# Altium project Project_Buran.PrjPcb
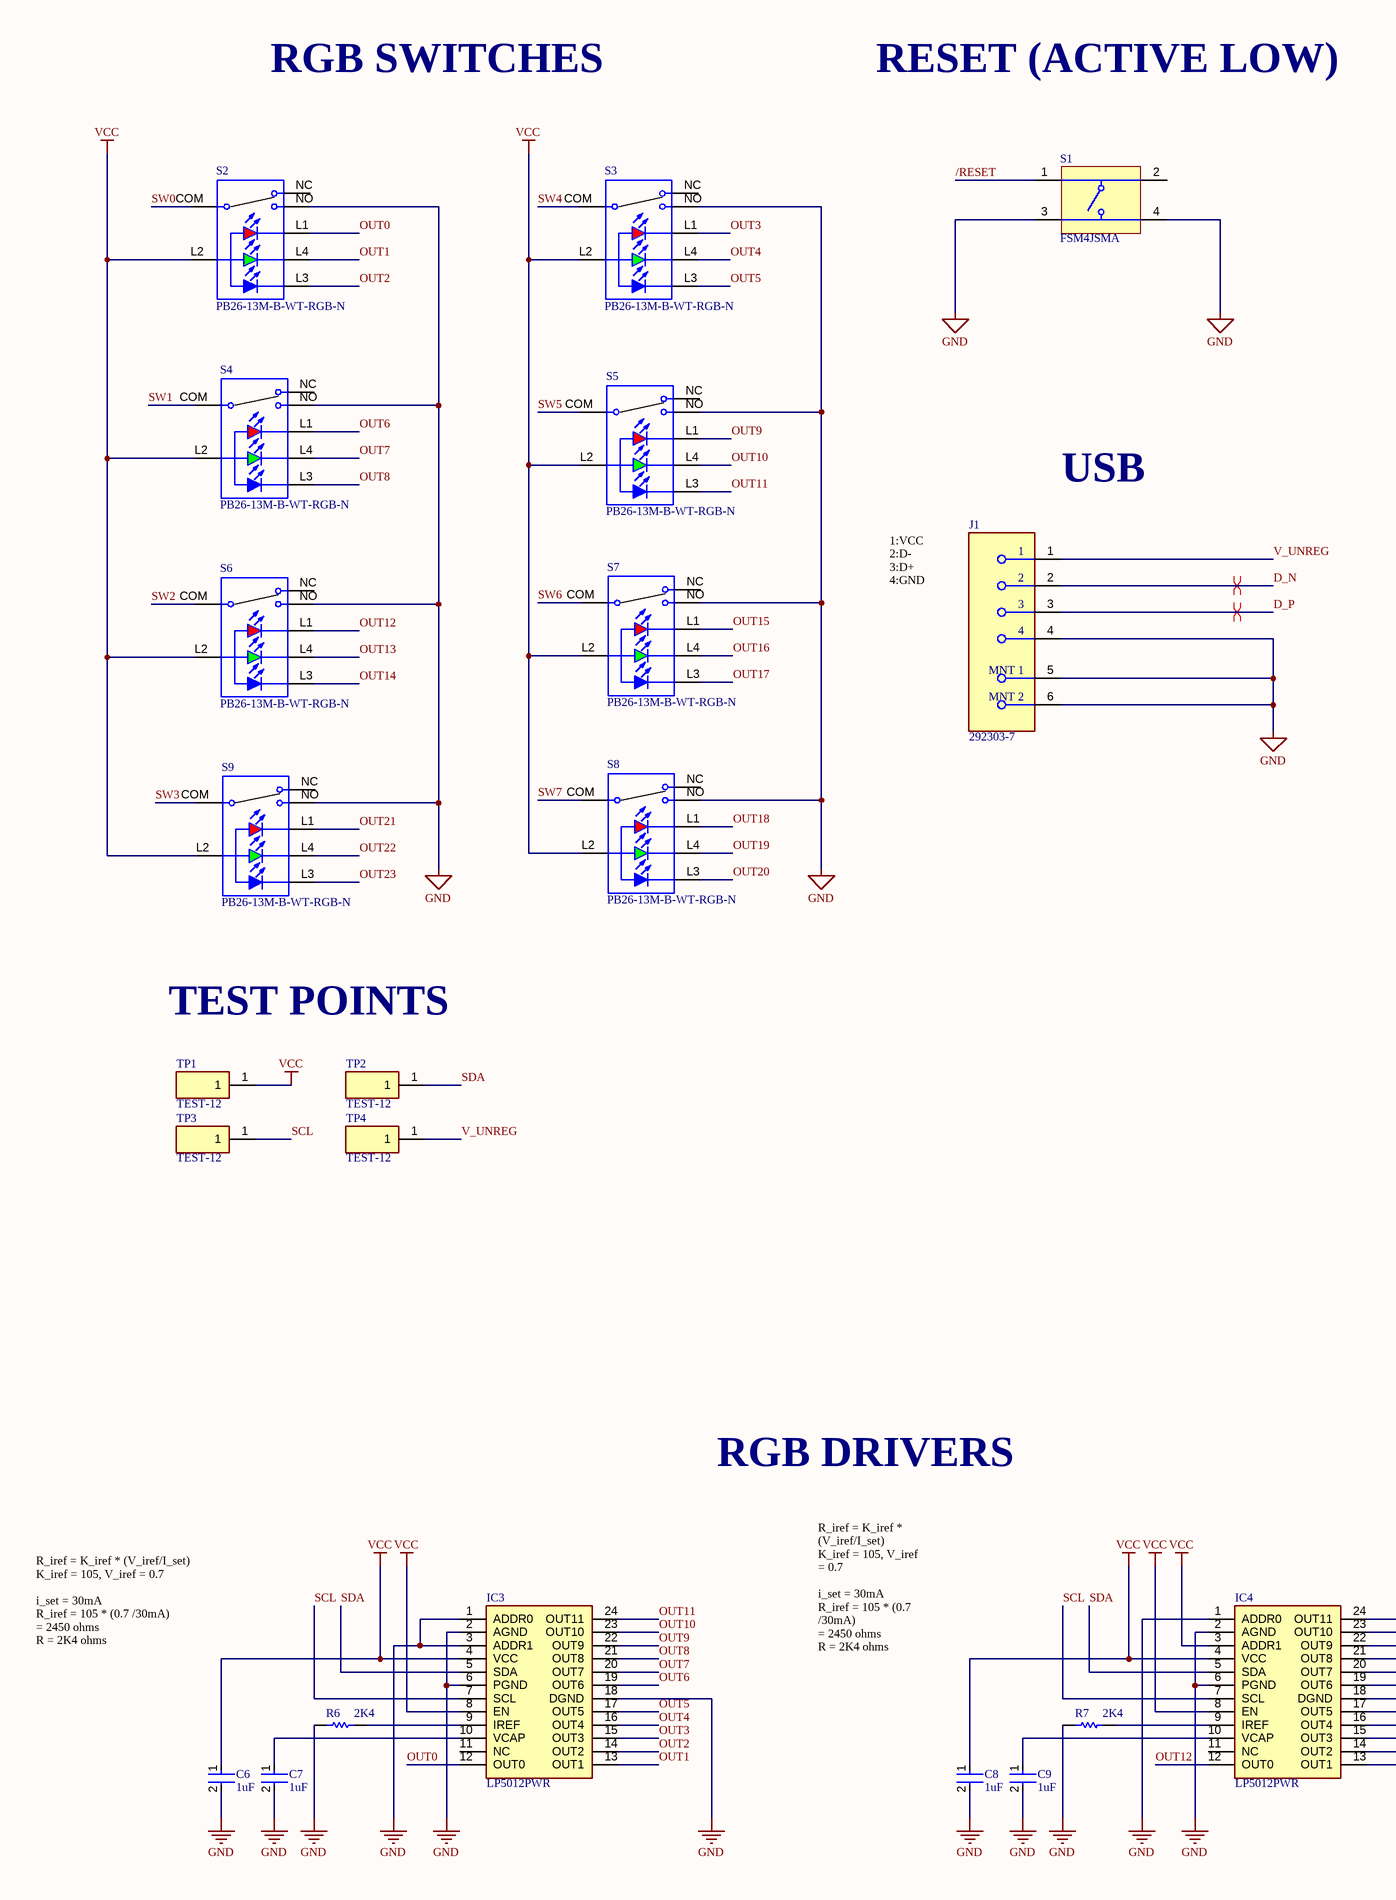
[diagram p0: project_buran_schematic.SchDoc, left]
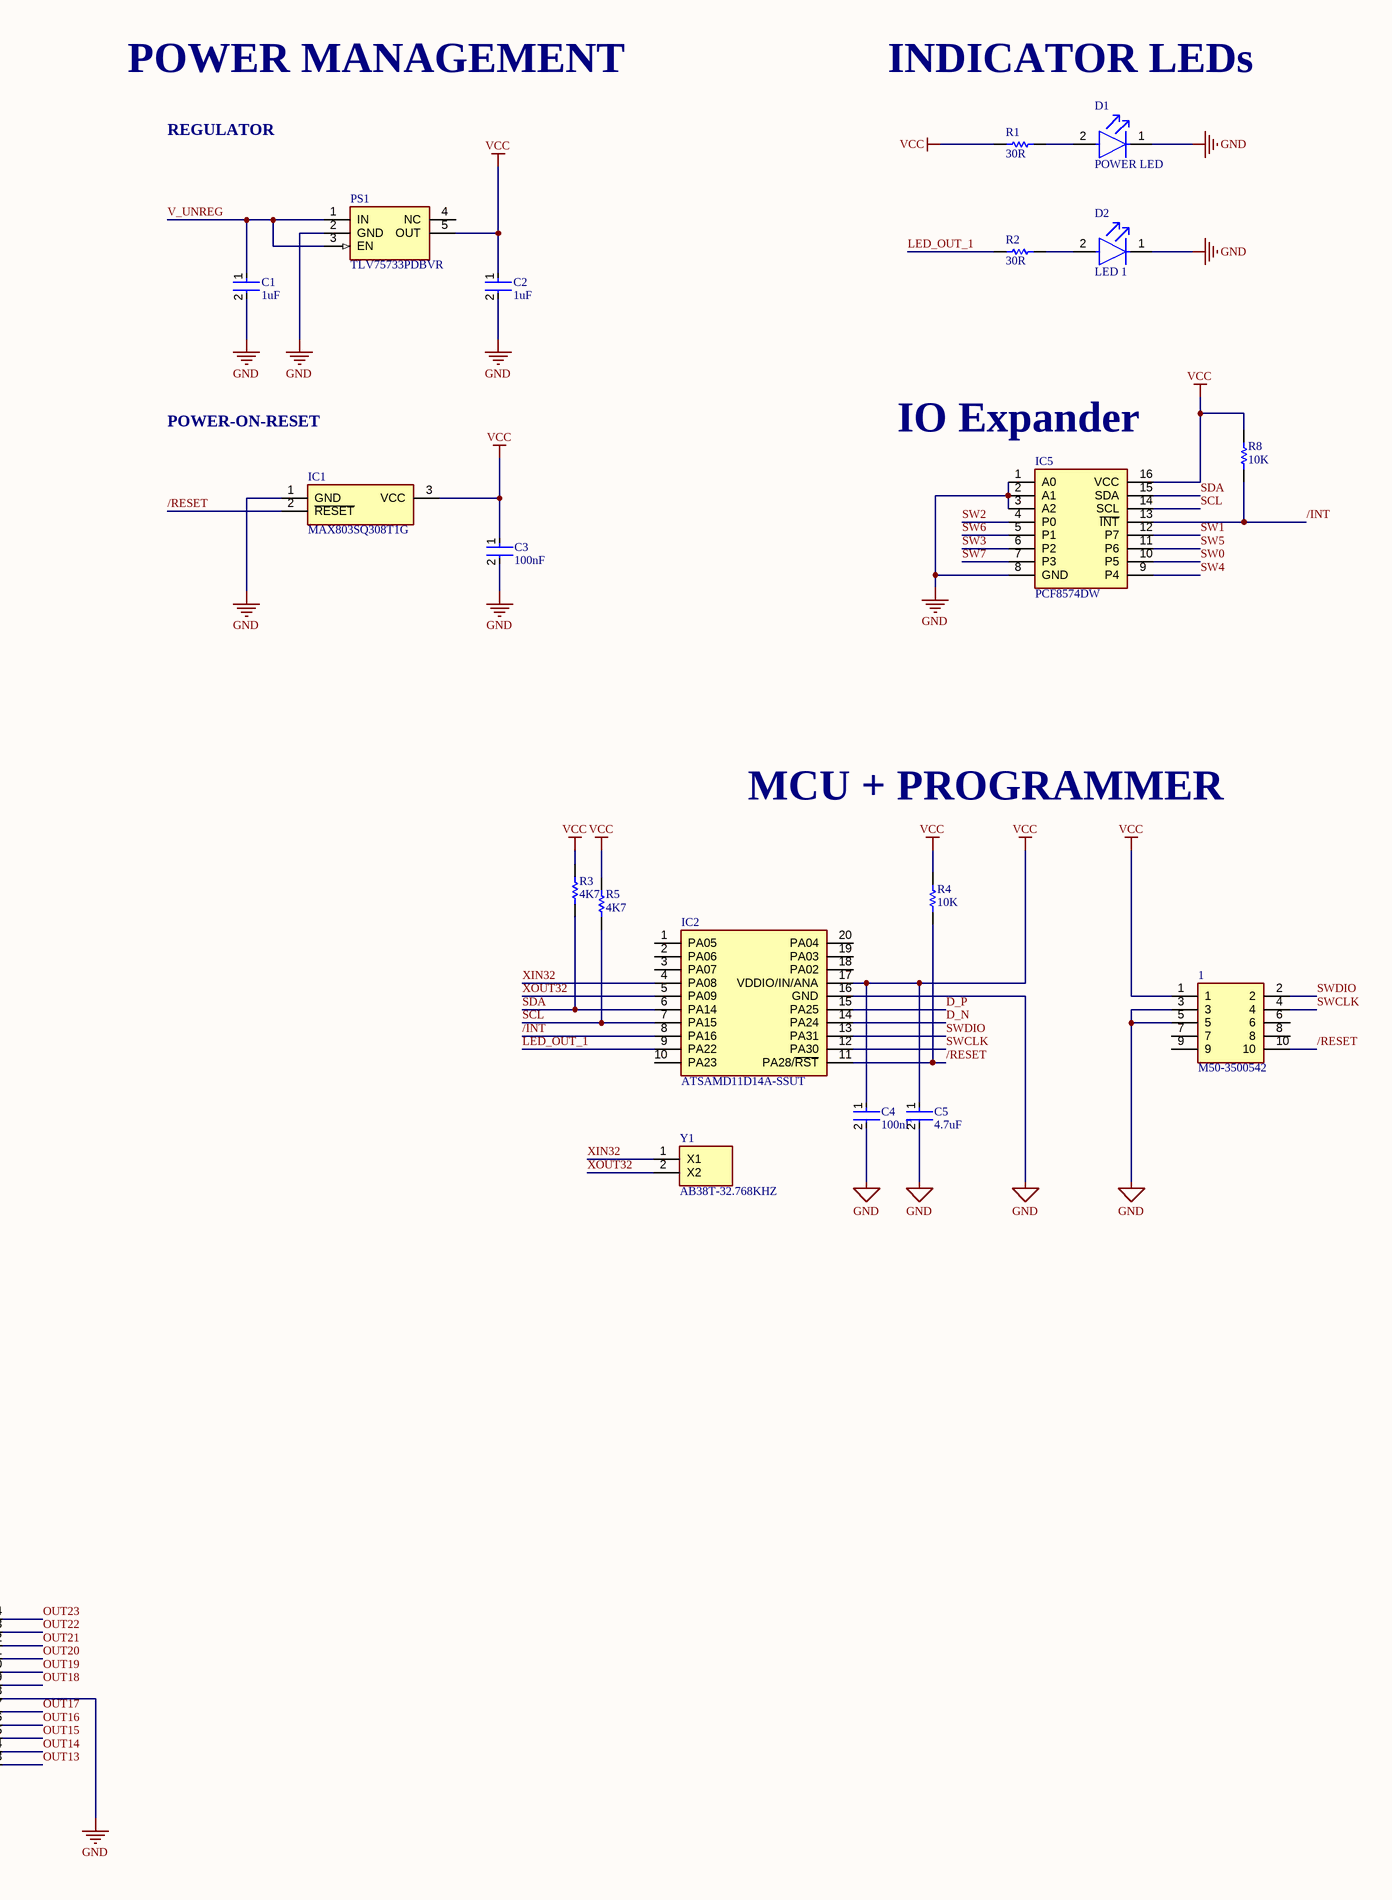
[diagram p1: project_buran_schematic.SchDoc, right]
1 sheet, 41 parts. Net scope: global (net labels, ports and power ports of the same name join across sheets).
Board file: project_buran.PcbDoc

## Sheet project_buran_schematic.SchDoc
size A2

### Parts
1  M50-3500542  [M503500542]
C1  1uF  [FP-GRM188-0_1-e0_2_0_55-IPC_A]
C2  1uF  [FP-GRM188-0_1-e0_2_0_55-IPC_A]
C3  100nF  [FP-GRM188-0_1-e0_2_0_55-IPC_A]
C4  100nF  [FP-GRM188-0_1-e0_2_0_55-IPC_A]
C5  4.7uF  [FP-GRM188-0_1-e0_2_0_55-IPC_A]
C6  1uF  [FP-GRM188-0_1-e0_2_0_55-IPC_A]
C7  1uF  [FP-GRM188-0_1-e0_2_0_55-IPC_A]
C8  1uF  [FP-GRM188-0_1-e0_2_0_55-IPC_A]
C9  1uF  [FP-GRM188-0_1-e0_2_0_55-IPC_A]
D1  POWER LED  [FP-LTST-C190GKT-MFG]
D2  LED 1  [FP-LTST-C190GKT-MFG]
IC1  MAX803SQ308T1G  [SOT65P220X100-3N]
IC2  ATSAMD11D14A-SSUT  [SOIC127P1032X265-20N]
IC3  LP5012PWR  [SOP65P640X120-24N]
IC4  LP5012PWR  [SOP65P640X120-24N]
IC5  PCF8574DW  [SOIC127P1030X265-16N]
J1  292303-7  [FP-292303-7-MFG]
PS1  TLV75733PDBVR  [SOT95P280X145-5N]
R1  30R  [RESC1609X50X30NL10T20]
R2  30R  [RESC1609X50X30NL10T20]
R3  4K7  [RESC1609X50X30NL10T20]
R4  10K  [RESC1609X50X30NL10T20]
R5  4K7  [RESC1609X50X30NL10T20]
R6  2K4  [RESC1609X50X30NL10T20]
R7  2K4  [RESC1609X50X30NL10T20]
R8  10K  [RESC1609X50X30NL10T20]
S1  FSM4JSMA  [TECO-FSM4JSMA_V]
S2  PB26-13M-B-WT-RGB-N  [PCBComponent_1 - duplicate]
S3  PB26-13M-B-WT-RGB-N  [PCBComponent_1 - duplicate]
S4  PB26-13M-B-WT-RGB-N  [PCBComponent_1 - duplicate]
S5  PB26-13M-B-WT-RGB-N  [PCBComponent_1 - duplicate]
S6  PB26-13M-B-WT-RGB-N  [PCBComponent_1 - duplicate]
S7  PB26-13M-B-WT-RGB-N  [PCBComponent_1 - duplicate]
S8  PB26-13M-B-WT-RGB-N  [PCBComponent_1 - duplicate]
S9  PB26-13M-B-WT-RGB-N  [PCBComponent_1 - duplicate]
TP1  TEST-12  [TEST12]
TP2  TEST-12  [TEST12]
TP3  TEST-12  [TEST12]
TP4  TEST-12  [TEST12]
Y1  AB38T-32.768KHZ  [AB38T32768KHZ]

### Nets
GND: 1.3 1.5 C1.2 C2.2 C3.2 C4.2 C5.2 C6.2 C7.2 C8.2 C9.2 D1.1(C) D2.1(C) IC1.1(GND) IC2.16(GND) IC3.1(ADDR0) IC3.2(AGND) IC3.3(ADDR1) IC3.6(PGND) IC3.18(DGND) IC4.1(ADDR0) IC4.2(AGND) IC4.6(PGND) IC4.18(DGND) IC5.1(A0) IC5.2(A1) IC5.3(A2) IC5.8(GND) J1.4 J1.5(MNT_1) J1.6(MNT_2) PS1.2(GND) R6.1 R7.1 S1.3 S1.4 S2.NO S3.NO S4.NO S5.NO S6.NO S7.NO S8.NO S9.NO
VCC: 1.1 C2.1 C3.1 C4.1 C5.1 C6.1 C8.1 IC1.3(VCC) IC2.17(VDDIO/IN/ANA) IC3.4(VCC) IC3.8(EN) IC4.3(ADDR1) IC4.4(VCC) IC4.8(EN) IC5.16(VCC) PS1.5(OUT) R1.2 R3.2 R4.2 R5.2 R8.2 S2.L2 S3.L2 S4.L2 S5.L2 S6.L2 S7.L2 S8.L2 S9.L2 TP1.1
/INT: IC2.8(PA16) IC5.13(~{INT}) R8.1
/RESET: 1.10 IC1.2(~{RESET}) IC2.11(PA28/~{RST}) R4.1 S1.1
D_N: IC2.14(PA24) J1.2
D_P: IC2.15(PA25) J1.3
LED_OUT_1: IC2.9(PA22) R2.2
OUT0: IC3.12(OUT0) S2.L1(L4)
OUT1: IC3.13(OUT1) S2.L4
OUT2: IC3.14(OUT2) S2.L3(L2)
OUT3: IC3.15(OUT3) S3.L1(L4)
OUT4: IC3.16(OUT4) S3.L4
OUT5: IC3.17(OUT5) S3.L3(L2)
OUT6: IC3.19(OUT6) S4.L1(L4)
OUT7: IC3.20(OUT7) S4.L4
OUT8: IC3.21(OUT8) S4.L3(L2)
OUT9: IC3.22(OUT9) S5.L1(L4)
OUT10: IC3.23(OUT10) S5.L4
OUT11: IC3.24(OUT11) S5.L3(L2)
OUT12: IC4.12(OUT0) S6.L1(L4)
OUT13: IC4.13(OUT1) S6.L4
OUT14: IC4.14(OUT2) S6.L3(L2)
OUT15: IC4.15(OUT3) S7.L1(L4)
OUT16: IC4.16(OUT4) S7.L4
OUT17: IC4.17(OUT5) S7.L3(L2)
OUT18: IC4.19(OUT6) S8.L1(L4)
OUT19: IC4.20(OUT7) S8.L4
OUT20: IC4.21(OUT8) S8.L3(L2)
OUT21: IC4.22(OUT9) S9.L1(L4)
OUT22: IC4.23(OUT10) S9.L4
OUT23: IC4.24(OUT11) S9.L3(L2)
SCL: IC2.7(PA15) IC3.7(SCL) IC4.7(SCL) IC5.14(SCL) R5.1 TP3.1
SDA: IC2.6(PA14) IC3.5(SDA) IC4.5(SDA) IC5.15(SDA) R3.1 TP2.1
SW0: IC5.10(P5) S2.COM
SW1: IC5.12(P7) S4.COM
SW2: IC5.4(P0) S6.COM
SW3: IC5.6(P2) S9.COM
SW4: IC5.9(P4) S3.COM
SW5: IC5.11(P6) S5.COM
SW6: IC5.5(P1) S7.COM
SW7: IC5.7(P3) S8.COM
SWCLK: 1.4 IC2.12(PA30)
SWDIO: 1.2 IC2.13(PA31)
V_UNREG: C1.1 J1.1 PS1.1(IN) PS1.3(EN) TP4.1
XIN32: IC2.4(PA08) Y1.1(X1)
XOUT32: IC2.5(PA09) Y1.2(X2)
NetC7_1: C7.1 IC3.10(VCAP)
NetC9_1: C9.1 IC4.10(VCAP)
NetD1_2: D1.2(A) R1.1
NetD2_2: D2.2(A) R2.1
NetIC3_9: IC3.9(IREF) R6.2
NetIC4_9: IC4.9(IREF) R7.2

Not connected (* = marked no-connect by the designer): 1 6 7 8 9; IC2 1(PA05) 2(PA06) 3(PA07) 10(PA23) 18(PA02) 19(PA03) 20(PA04); IC3 11(NC); IC4 11(NC); PS1 4(NC); S1 2; S2 NC; S3 NC; S4 NC; S5 NC; S6 NC; S7 NC; S8 NC; S9 NC

### Layout directives
differential pair: D_N, D_P

### Notes on the sheet
- RGB SWITCHES
- RESET (ACTIVE LOW)
- POWER MANAGEMENT
- INDICATOR LEDs
- REGULATOR
- POWER-ON-RESET
- (near IC5) IO Expander
- USB
- 1:VCC
  2:D-
  3:D+
  4:GND
- MCU + PROGRAMMER
- TEST POINTS
- RGB DRIVERS
- R_iref = K_iref * (V_iref/I_set)
  K_iref = 105, V_iref = 0.7
  i_set = 30mA
  R_iref = 105 * (0.7 /30mA)
  = 2450 ohms
  R = 2K4 ohms
- DWG. NO.
- REV.
- SHT.
- REVISION
- DESCRIPTION
- DATE
- APPROVED
- THIS DOCUMENT AND THE DATA DISCLOSED HEREIN OR HEREWITH IS THE PROPERTY OF ALTIUM LIMITED AND MAY BE FREELY DISTRIBUTED IN WHOLE. NO RIGHTS ARE RESERVED OR EXPRESS OR IMPLIED WARANTEE GIVEN.
- ENG:
- DSN:
- APPROVALS
- PROJECT
- DOCUMENT REVISION:
- DESIGN ITEM:
- CHK:
- BOM:
- REFERENCE DOCUMENTS
- PROJECT REVISION:
- TITLE
- FAB DWG:
- PCB DWG:
- ASSY DWG:
- SCALE:
- SIZE
- C
- CAGE CODE
- FILE NAME
- DWG NO.
- SHEET
- OF
- REV

### Library data of the parts
1 = M50-3500542: Connector; Manufacturer_Name: Harwin; Datasheet Link: http://docs-emea.rs-online.com/webdocs/13d4/0900766b813d4011.pdf; Height: 4.15mm; Manufacturer_Part_Number: M50-3500542; Mouser Part Number: 855-M50-3500542; Mouser Price/Stock: https://www.mouser.co.uk/ProductDetail/Harwin/M50-3500542?qs=9fQaSFfsqsyXI0P9tFOVoQ%3D%3D
C1-C9 = CMP-2006-02792-2: Chip Multilayer Ceramic Capacitors for General Purpose, 0603, 10uF, X5R, 15%, 20%, 6.3V; Packaging: Tape and Reel; Voltage Rating (DC): 6.3V; Width: 0.031inch; Termination: SMD/SMT; Dielectric: X5R; Package Quantity: 4000; Voltage Rating: 6.3V; Capacitance: 10uF; Case/Package: 0603; Min Operating Temperature: -55°C; Voltage: 6.3V; Length: 1.6mm; Thickness: 0.035inch; Lead Free: Lead Free; Depth: 0.8mm; Case Code (Imperial): 0603; Max Operating Temperature: 85°C; Material: Ceramic; Height: 0.8mm; Tolerance: 20%; Mount: Surface Mount; REACH SVHC: No SVHC; Radiation Hardening: No; Case Code (Metric): 1608
D1 D2 = CMP-22017-000005-2: LED GREEN CLEAR CHIP SMD; Dominant Wavelength: 569nm; Reverse Voltage: 5V; Lens Color: Colorless; Viewing Angle: 130°; Voltage: 2V; Forward Current: 30mA; Power Dissipation: 100mW; Luminous Intensity: 6mcd; Number of LEDs: 1; Forward Voltage: 2.1V; Wavelength: 565nm; Test Current: 10mA; Min Operating Temperature: -55°C; Lens Style: Clear; Mount: Surface Mount; Width: 0.8mm; Packaging: Tape and Reel; Lens Transparency: Clear; Case Code (Metric): 1608; Depth: 0.8mm; Case Code (Imperial): 0603; Case/Package: 0603; Number of Pins: 2; Max Operating Temperature: 85°C; Lead Free: Lead Free; Number of Elements: 1; Length: 1.6mm; Height: 0.8mm; Package Quantity: 1; Power Rating: 100mW; Radiation Hardening: No; Illumination Color: Green; Color: Green
IC1 = MAX803SQ308T1G: Integrated Circuit; Manufacturer_Name: ON Semiconductor; Datasheet Link: http://www.onsemi.com/pub/Collateral/MAX803-D.PDF; Height: 1mm; Manufacturer_Part_Number: MAX803SQ308T1G; Mouser Part Number: 863-MAX803SQ308T1G; Mouser Price/Stock: https://www.mouser.co.uk/ProductDetail/ON-Semiconductor/MAX803SQ308T1G?qs=aSUclzrs14xj4ys5ck7Tew%3D%3D; Arrow Part Number: MAX803SQ308T1G; Arrow Price/Stock: https://www.arrow.com/en/products/max803sq308t1g/on-semiconductor
IC2 = ATSAMD11D14A-SSUT: Integrated Circuit; Manufacturer_Name: Microchip; Datasheet Link: http://ww1.microchip.com/downloads/en/devicedoc/atmel-42363-sam-d11_datasheet.pdf; Height: 2.65mm; Manufacturer_Part_Number: ATSAMD11D14A-SSUT; Mouser Part Number: 556-ATSAMD11D14ASSUT; Mouser Price/Stock: https://www.mouser.co.uk/ProductDetail/Microchip-Technology-Atmel/ATSAMD11D14A-SSUT/?qs=lrqjml%252Bjt8f8EFewxXrzCw%3D%3D; Arrow Part Number: ATSAMD11D14A-SSUT; Arrow Price/Stock: https://www.arrow.com/en/products/atsamd11d14a-ssut/microchip-technology
IC3 IC4 = LP5012PWR: Integrated Circuit; Manufacturer_Name: Texas Instruments; Datasheet Link: https://www.ti.com/lit/ds/symlink/lp5012.pdf?ts=1615929314042&ref_url=https%253A%252F%252Fwww.mouser.co.uk%252F; Height: 1.2mm; Manufacturer_Part_Number: LP5012PWR; Mouser Part Number: 595-LP5012PWR; Mouser Price/Stock: https://www.mouser.co.uk/ProductDetail/Texas-Instruments/LP5012PWR/?qs=T94vaHKWudSL6jLwBy12Hg%3D%3D
IC5 = PCF8574DW: Integrated Circuit; Manufacturer_Name: Texas Instruments; Datasheet Link: http://www.ti.com/lit/ds/symlink/pcf8574.pdf; Height: 2.65mm; Manufacturer_Part_Number: PCF8574DW; Mouser Part Number: 595-PCF8574DW; Mouser Price/Stock: https://www.mouser.co.uk/ProductDetail/Texas-Instruments/PCF8574DW?qs=wgAEGBTxy7mRAJubebRPoQ%3D%3D; Arrow Part Number: PCF8574DW; Arrow Price/Stock: https://www.arrow.com/en/products/pcf8574dw/texas-instruments
J1 = CMP-03360-000008-1: CONN RCPT USB2.0 TYPEA 4P SMD RA; Manufacturer: TE Connectivity; Is Female: yes; Current Rating: 1A; Number Of Contacts: 4; Voltage Rating: 30V; Conn Orientation: Right Angle; Shielding: true; Digikey Description: CONN RCPT USB2.0 TYPEA 4P SMD RA; Manufacturer Part Number: 292303-7; Automotive: No; Category: Conn; Temperature: -55°C to +85°C; ComponentLink2Description: Datasheet; Mouser Description: USB Connectors USB A R/A Recpt Assy SMT; Contact Material: Gold,Nickel; Package: 292303-7; Device Class L3: unset; Octopart: https://octopart.com/292303-7-te+connectivity-42840369; RoHS: TRUE; Device Class L2: USB Connectors; ComponentLink2URL: https://www.te.com/usa-en/product-292303-7.html?te_bu=Cor&te_type=other&te_campaign=oct_glo_cor-oct-global-oth-prtnr-fy19-oct-octo-buy-bom_sma-298_2&elqCampaignId=35216; Temperature Range Low: -55°C; Usb Standard: USB 2.0; Temperature Range High: +85°C; Lead Free: Yes; Device Class L1: Connectors
PS1 = TLV75733PDBVR: Power Supply; Manufacturer_Name: Texas Instruments; Datasheet Link: http://www.ti.com/lit/gpn/tlv757p; Height: 1.45mm; Manufacturer_Part_Number: TLV75733PDBVR; Mouser Part Number: 595-TLV75733PDBVR; Mouser Price/Stock: https://www.mouser.co.uk/ProductDetail/Texas-Instruments/TLV75733PDBVR?qs=y6ZabgHbY%252BwAAzSntTW34w%3D%3D; Arrow Part Number: TLV75733PDBVR; Arrow Price/Stock: https://www.arrow.com/en/products/tlv75733pdbvr/texas-instruments
R1-R8 = CMP-2000-03854-1: Part Number: CRCW0603110RFKEA; Manufacturer: Vishay Dale
S1 = CMP-2000-05602-2: Swicth, SPST, 24 V, -35 to 85 degC, 4-Pin SMD, RoHS, Tape and Reel; Manufacturer: TE Connectivity; Switch Travel: 0.25mm; Mechanical Life: 100000Cycles; Contact Current Rating: 50mA; Operating Force: 1.57N; Actuator Material: Polyamide; Contact Resistance: 100mOhm; Voltage Rating: 24V; Illumination Type: Illuminated; Actuator Length: 0.055inch; Max Voltage Rating (DC): 12V; Case\/Package: SMD/SMT; Orientation: Straight; Datasheet URL: http://www.te.com/commerce/DocumentDelivery/DDEController?Action=showdoc&DocId=Customer+Drawing%7F2-1437565-7%7FV%7Fpdf%7FEnglish%7FENG_CD_2-1437565-7_V.pdf%7F4-1437565-2; Min Operating Temperature: -35degC; Packaging: LoosePiece; Termination: GullWing; Throw Configuration: SPST; Package Description: 4-Pin Surface Mount Device, Body 6 x 6 mm, Pitch 4.5 mm; Mounting Technology: SurfaceMount; Contact Plating: Silver; Datasheet Version: Rev. V, 02/2015; RoHSCompliant: true; Max Operating Temperature: 85degC; Length: 6mm; Voltage Rating (DC): 24V; Electrical Life: 100000Cycles; Current Rating: 50mA; Package Quantity: 750; Mount: SurfaceMount; Package Reference: FSM4JSMA; Manufacturer URL: http://www.te.com/; Width: 6mm; REACH SVHC: Unknown; Contact Material: CopperAlloy
S2-S9 = PB26-13M-B-WT-RGB-N: WS-PBTL Illuminated THT Push Button Switch, Red & Green & Blue; Part Number: 465M111172501; Operation Force: 200gf; Rated Voltage: 12VDC; Rated Current: 100mA; ComponentLink1Description: Manufacturer; ComponentLink1URL: http://www.we-online.de; ComponentLink2Description: Datasheet; ComponentLink2URL: https://katalog.we-online.com/em/datasheet/465M111172501.pdf; Published Date: September 2019; Publisher: Wurth Elektronik; Contact Material: Copper Alloy; Emitting Color: Red & Green & Blue; Mounting Technology: THT; Contact Plating: Gold; Packaging: ESD Tray; Size: 15x15mm; Operating Temperature: -40 to +85degC; Terminal Plating: Tin; Terminal Material: Copper Alloy
TP1-TP4 = TEST-12: Test Point; Manufacturer_Name: MULTICOMP; Datasheet Link: https://componentsearchengine.com/Datasheets/2/TEST-12.pdf; Height: 7mm; Manufacturer_Part_Number: TEST-12
Y1 = AB38T-32.768KHZ: Crystal or Oscillator; Manufacturer_Name: ABRACON; Datasheet Link: http://www.abracon.com/Resonators/AB38T.pdf; Height: 8.3mm; Manufacturer_Part_Number: AB38T-32.768KHZ; Mouser Part Number: 815-AB38T-32.768KHZ; Mouser Price/Stock: https://www.mouser.co.uk/ProductDetail/ABRACON/AB38T-32768KHZ/?qs=m%252BUhWDcpCfbdp9ovMbeW3g%3D%3D; Arrow Part Number: AB38T-32.768KHZ; Arrow Price/Stock: https://www.arrow.com/en/products/ab38t-32.768khz/abracon